# EAGLE board pm3-16 (EAGLE 7.4.0)
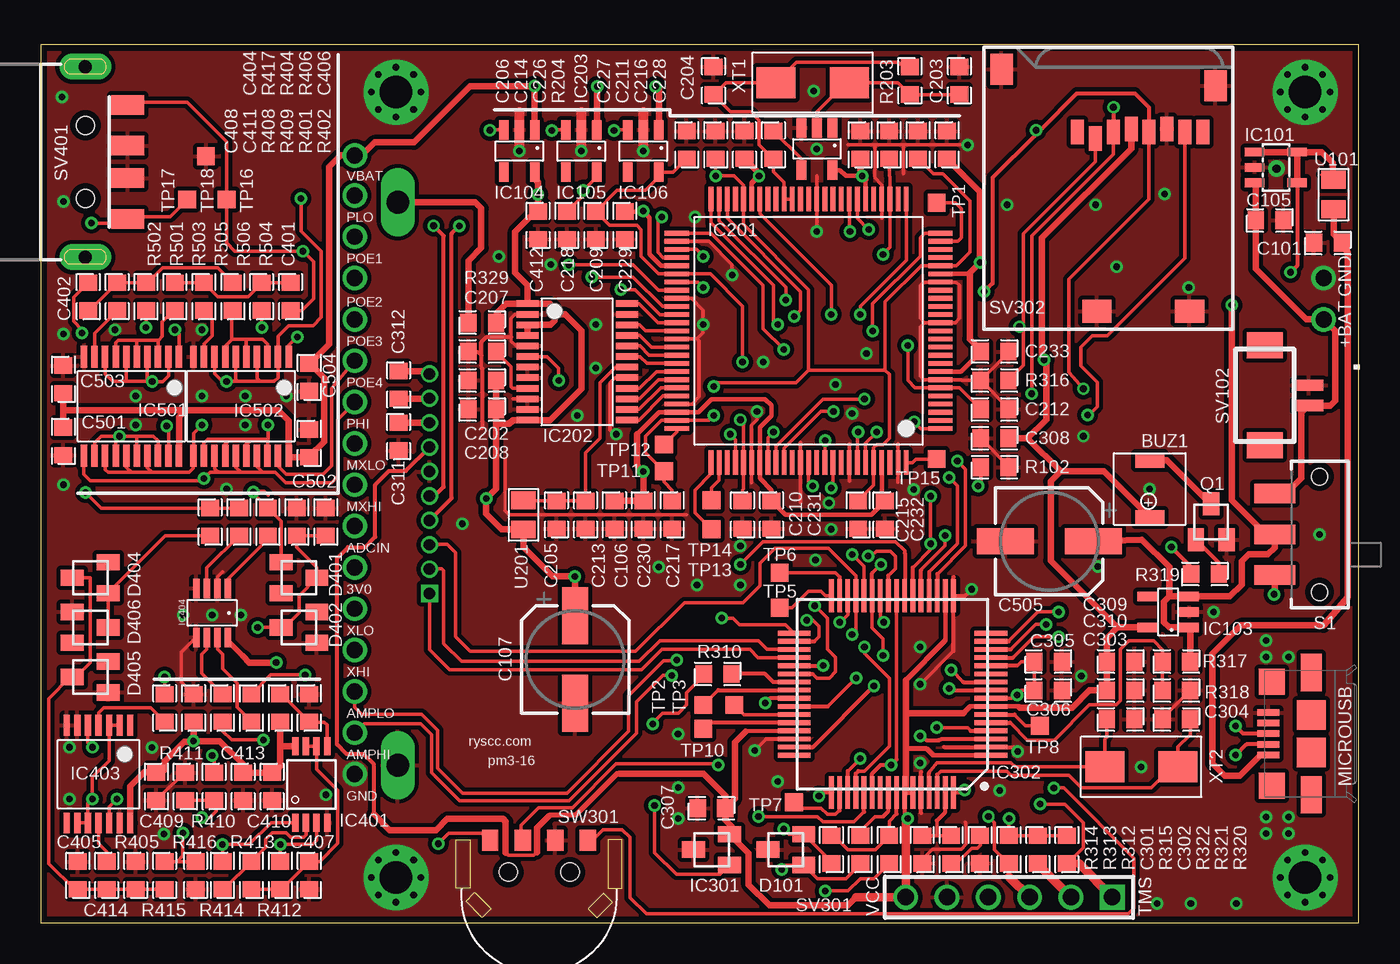
[diagram p5: board, top side]
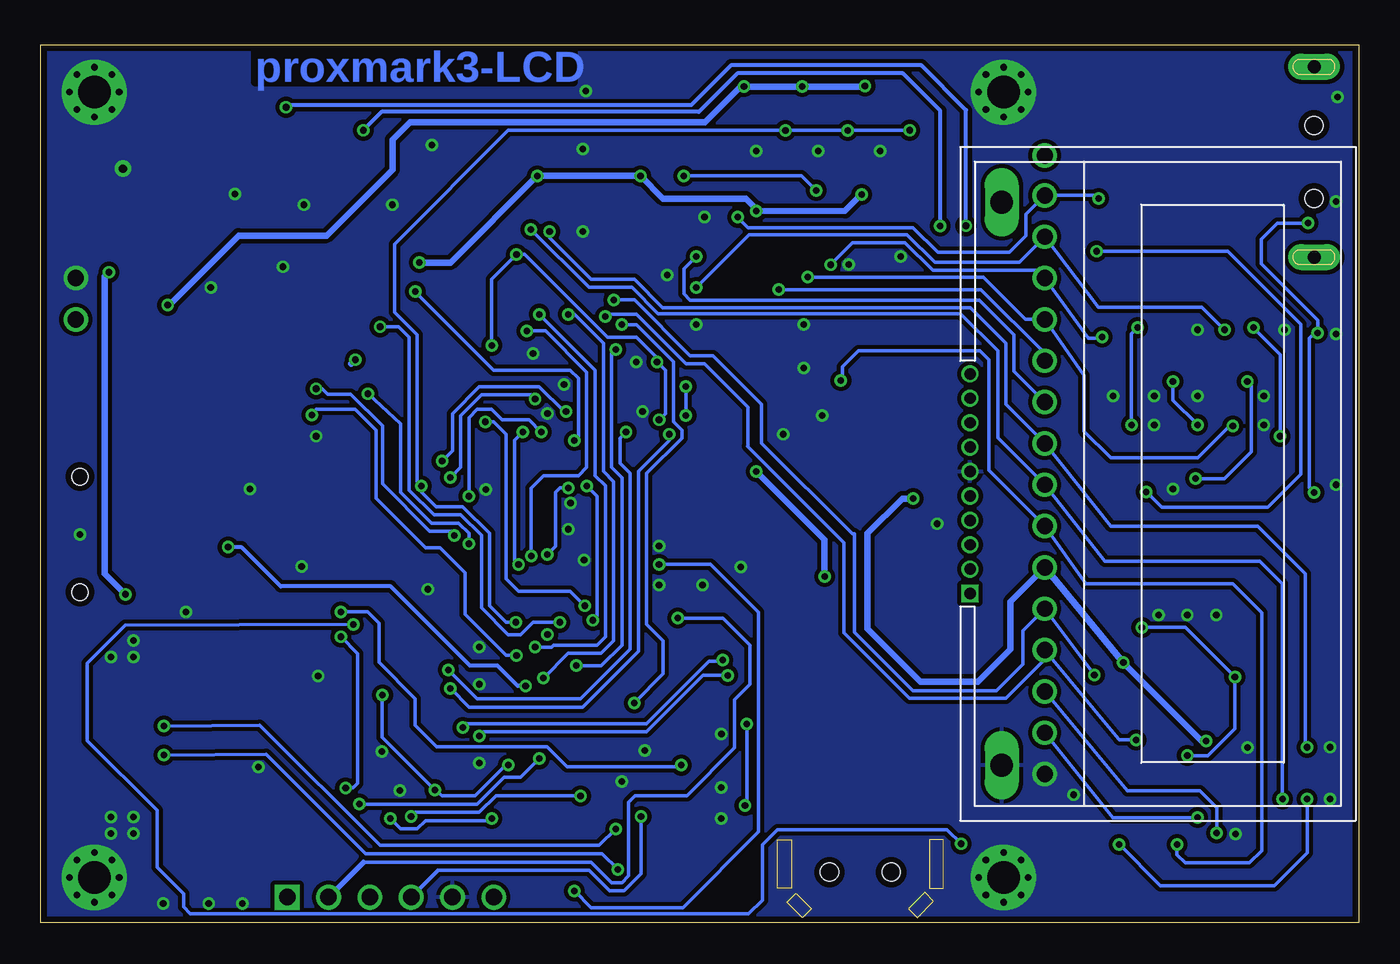
[diagram p6: board, bottom side, seen from below]

Size 81.03 x 53.98 mm. Coordinates in mm from the lower left corner, seen from the top.
Outline: 81.03,0 81.03,53.98 0,53.98 0,0 81.03,0
Copper layers (1*16): Top 0.0356mm / dielectric 1.5011mm / Bottom 0.0356mm
Design rules "LaenPCBOrder": minimum track width 6mil, minimum drill 13mil, track to track 6mil, track to pad 6mil, pad to pad 6mil, via to via 6mil, smd to smd 6mil, copper to edge 15mil, drill to drill 6mil, minimum pad ring 7mil, minimum via ring 7mil, stop-mask expansion 3mil, vias tented up to drill 0mil, thermal gap 10mil

## Footprints (pad centres in the part's own frame; a part is rotated, then mirrored left to right if it is on the bottom)
BUZZER_SMD = smd 0.9 x 1.8: P$1 -1.75,0; P$2 1.75,0
0603 = smd 1 x 1.1: 1 -0.85,0; 2 0.85,0
153CLV-0605 = smd 3.5 x 1.6: + 2.7,0; - -2.7,0
SOT-23-3 = smd 1 x 1.4: 1 -0.95,-1.1; 2 0.95,-1.1; 3 0,1.1
SOT23-5L = smd 0.55 x 1.2: 1 -0.95,-1.3; 2 0,-1.3; 3 0.95,-1.3; 4 0.95,1.3; 5 -0.95,1.3
SOT-23-5 = smd 0.6 x 1.2: 1 -0.95,-1.3; 2 0,-1.3; 3 0.95,-1.3; 4 0.95,1.3; 5 -0.95,1.3
VQ100 = smd 1.5 x 0.29: 1 -8.1,6; 2 -8.1,5.5; 3 -8.1,5; 4 -8.1,4.5; 5 -8.1,4; 6 -8.1,3.5; 7 -8.1,3; 8 -8.1,2.5; 9 -8.1,2; 10 -8.1,1.5; 11 -8.1,1; 12 -8.1,0.5; 13 -8.1,0; 14 -8.1,-0.5; 15 -8.1,-1; 16 -8.1,-1.5; 17 -8.1,-2; 18 -8.1,-2.5; 19 -8.1,-3; 20 -8.1,-3.5; 21 -8.1,-4; 22 -8.1,-4.5; 23 -8.1,-5; 24 -8.1,-5.5; 25 -8.1,-6; 51 8.1,-6; 52 8.1,-5.5; 53 8.1,-5; 54 8.1,-4.5; 55 8.1,-4; 56 8.1,-3.5; 57 8.1,-3; 58 8.1,-2.5; 59 8.1,-2; 60 8.1,-1.5; 61 8.1,-1; 62 8.1,-0.5; 63 8.1,0; 64 8.1,0.5; 65 8.1,1; 66 8.1,1.5; 67 8.1,2; 68 8.1,2.5; 69 8.1,3; 70 8.1,3.5; 71 8.1,4; 72 8.1,4.5; 73 8.1,5; 74 8.1,5.5; 75 8.1,6 | smd 0.29 x 1.5: 26 -6,-8.1; 27 -5.5,-8.1; 28 -5,-8.1; 29 -4.5,-8.1; 30 -4,-8.1; 31 -3.5,-8.1; 32 -3,-8.1; 33 -2.5,-8.1; 34 -2,-8.1; 35 -1.5,-8.1; 36 -1,-8.1; 37 -0.5,-8.1; 38 0,-8.1; 39 0.5,-8.1; 40 1,-8.1; 41 1.5,-8.1; 42 2,-8.1; 43 2.5,-8.1; 44 3,-8.1; 45 3.5,-8.1; 46 4,-8.1; 47 4.5,-8.1; 48 5,-8.1; 49 5.5,-8.1; 50 6,-8.1; 76 6,8.1; 77 5.5,8.1; 78 5,8.1; 79 4.5,8.1; 80 4,8.1; 81 3.5,8.1; 82 3,8.1; 83 2.5,8.1; 84 2,8.1; 85 1.5,8.1; 86 1,8.1; 87 0.5,8.1; 88 0,8.1; 89 -0.5,8.1; 90 -1,8.1; 91 -1.5,8.1; 92 -2,8.1; 93 -2.5,8.1; 94 -3,8.1; 95 -3.5,8.1; 96 -4,8.1; 97 -4.5,8.1; 98 -5,8.1; 99 -5.5,8.1; 100 -6,8.1
TSSOP24 = smd 0.4 x 1.35: 1 -3.575,-3.05; 2 -2.925,-3.05; 3 -2.275,-3.05; 4 -1.625,-3.05; 5 -0.975,-3.05; 6 -0.325,-3.05; 7 0.325,-3.05; 8 0.975,-3.05; 9 1.625,-3.05; 10 2.275,-3.05; 11 2.925,-3.05; 12 3.575,-3.05; 13 3.575,3.05; 14 2.925,3.05; 15 2.275,3.05; 16 1.625,3.05; 17 0.975,3.05; 18 0.325,3.05; 19 -0.325,3.05; 20 -0.975,3.05; 21 -1.625,3.05; 22 -2.275,3.05; 23 -2.925,3.05; 24 -3.575,3.05
LQFP64 = smd 0.29 x 2: 1 -3.75,-6.05; 2 -3.25,-6.05; 3 -2.75,-6.05; 4 -2.25,-6.05; 5 -1.75,-6.05; 6 -1.25,-6.05; 7 -0.75,-6.05; 8 -0.25,-6.05; 9 0.25,-6.05; 10 0.75,-6.05; 11 1.25,-6.05; 12 1.75,-6.05; 13 2.25,-6.05; 14 2.75,-6.05; 15 3.25,-6.05; 16 3.75,-6.05; 33 3.75,6.05; 34 3.25,6.05; 35 2.75,6.05; 36 2.25,6.05; 37 1.75,6.05; 38 1.25,6.05; 39 0.75,6.05; 40 0.25,6.05; 41 -0.25,6.05; 42 -0.75,6.05; 43 -1.25,6.05; 44 -1.75,6.05; 45 -2.25,6.05; 46 -2.75,6.05; 47 -3.25,6.05; 48 -3.75,6.05 | smd 2 x 0.29: 17 6.05,-3.75; 18 6.05,-3.25; 19 6.05,-2.75; 20 6.05,-2.25; 21 6.05,-1.75; 22 6.05,-1.25; 23 6.05,-0.75; 24 6.05,-0.25; 25 6.05,0.25; 26 6.05,0.75; 27 6.05,1.25; 28 6.05,1.75; 29 6.05,2.25; 30 6.05,2.75; 31 6.05,3.25; 32 6.05,3.75; 49 -6.05,3.75; 50 -6.05,3.25; 51 -6.05,2.75; 52 -6.05,2.25; 53 -6.05,1.75; 54 -6.05,1.25; 55 -6.05,0.75; 56 -6.05,0.25; 57 -6.05,-0.25; 58 -6.05,-0.75; 59 -6.05,-1.25; 60 -6.05,-1.75; 61 -6.05,-2.25; 62 -6.05,-2.75; 63 -6.05,-3.25; 64 -6.05,-3.75
MSOP8 = smd 0.4 x 1.1: 1 -0.975,-2.35; 2 -0.325,-2.35; 3 0.325,-2.35; 4 0.975,-2.35; 5 0.975,2.35; 6 0.325,2.35; 7 -0.325,2.35; 8 -0.975,2.35
TSSOP14 = smd 0.381 x 1.27: 1 -1.95,-3; 2 -1.3,-3; 3 -0.65,-3; 4 0,-3; 5 0.65,-3; 6 1.3,-3; 7 1.95,-3; 8 1.95,3; 9 1.3,3; 10 0.65,3; 11 0,3; 12 -0.65,3; 13 -1.3,3; 14 -1.95,3
SOT-23-8 = smd 0.4 x 1.2: 1 -0.975,-1.5; 2 -0.325,-1.5; 3 0.325,-1.5; 4 0.975,-1.5; 5 0.975,1.5; 6 0.325,1.5; 7 -0.325,1.5; 8 -0.975,1.5
TSSOP20 = smd 0.4 x 1.35: 1 -2.925,-3.05; 2 -2.275,-3.05; 3 -1.625,-3.05; 4 -0.975,-3.05; 5 -0.325,-3.05; 6 0.325,-3.05; 7 0.975,-3.05; 8 1.625,-3.05; 9 2.275,-3.05; 10 2.925,-3.05; 11 2.925,3.05; 12 2.275,3.05; 13 1.625,3.05; 14 0.975,3.05; 15 0.325,3.05; 16 -0.325,3.05; 17 -0.975,3.05; 18 -1.625,3.05; 19 -2.275,3.05; 20 -2.925,3.05
NHD-C0216CZ-FSW-FBW-3V3 = drill 0.7 square: 1 27.45,0.6 | drill 0.7: 2 25.95,0.6; 3 24.45,0.6; 4 22.95,0.6; 5 21.45,0.6; 6 19.95,0.6; 7 18.45,0.6; 8 16.95,0.6; 9 15.45,0.6; 10 13.95,0.6 | drill 1.4 long: A 3.4,2.55; K 38,2.55
1981584-1 = smd 0.4 x 1.35: 1 -1.3,4.1; 2 -0.65,4.1; 3 0,4.1; 4 0.65,4.1; 5 1.3,4.1 | smd 1.8 x 1.8: M1 -1.15,1.45; M2 1.15,1.45 | smd 2.3 x 1.3: S1 -3.75,1.45; S2 3.75,1.45 | smd 1.6 x 1.6: S3 -3.2,3.885; S4 3.2,3.885
SWITCH-SPDT-SMD = smd 1.2 x 2.5: 1 -2.5,-2.75; 2 0,-2.75; 3 2.5,-2.75 | hole 1: -3.55,0; 3.55,0
DF13C-2P-1.25V = smd 1.6 x 2.2: M$0 3.075,-1.8; M$1 -3.075,-1.8 | smd 0.7 x 1.8: P$1 -0.625,0.9; P$2 0.625,0.9
HEADER-1X6 = drill 1.016 square: 1 -6.35,0 | drill 1.016: 2 -3.81,0; 3 -1.27,0; 4 1.27,0; 5 3.81,0; 6 6.35,0
3M-MICROSD = smd 0.8 x 1.5: 1 -1.89,3.45; 2 -0.79,3.05; 3 0.31,3.45; 4 1.41,3.65; 5 2.51,3.45; 6 3.61,3.65; 7 4.71,3.45; 8 5.81,3.45 | smd 1.4 x 1.9: 9 6.6,6.3; 10 -6.55,7.3 | smd 1.8 x 1.4: 11 -0.7,-7.55; 12 5,-7.55
USB-A-SMT-MALE = smd 1.2 x 2: D+1 1,-5.35; D-1 -1,-5.35; GND1 3.5,-5.35; VBUS1 -3.5,-5.35 | drill 0.8 pad 1.6 long: P$1 5.85,-2.75; P$3 -5.85,-2.75 | hole 1.1: 2.25,-2.75; -2.25,-2.75
SLLB510100 = smd 1 x 1.3: 1 -2.99,-0.952; 2 3.01,-0.952; C -0.99,-0.952; T 1.01,-0.952 | hole 1.1: -1.9,1; 1.9,1
TP06SQ = smd 1.1 x 1.1: TP 0,0
0805 = smd 1.1 x 1.5: 1 -0.9,0; 2 0.9,0
6035 = smd 2.4 x 1.9: 1 -2.25,0; 2 2.25,0

## Placement (x,y rotation side)
BUZ1  BUZZER_SMD  [BUZZER_SMD]  68.18,26.67 90 top
C101  1u  [0603]  79.12,41.78 180 top
C105  1u  [0603]  75.54,43.17 0 top
C106  4u7  [0603]  35.27,25.08 270 top
C107  100u  [153CLV-0605]  32.85,16.19 90 top
C202  1u  [0603]  27.14,33.33 180 top
C203  22p  [0603]  56.48,51.75 90 top
C204  22p  [0603]  41.36,51.75 90 top
C205  1u  [0603]  31.71,25.08 270 top
C206  4u7  [0603]  39.71,47.81 90 top
C207  100n  [0603]  27.14,35.11 180 top
C208  100n  [0603]  27.14,31.55 180 top
C209  100n  [0603]  34.12,42.86 270 top
C210  100n  [0603]  43.14,25.08 270 top
C211  100n  [0603]  52.16,47.81 90 top
C212  100n  [0603]  58.63,31.55 0 top
C213  100n  [0603]  33.49,25.08 270 top
C214  100n  [0603]  41.49,47.81 90 top
C215  100n  [0603]  50.25,25.08 270 top
C216  100n  [0603]  53.94,47.81 90 top
C217  100n  [0603]  38.82,25.08 270 top
C218  4u7  [0603]  32.35,42.86 270 top
C226  100n  [0603]  43.27,47.81 90 top
C227  100n  [0603]  50.38,47.81 90 top
C228  100n  [0603]  55.71,47.81 90 top
C229  100n  [0603]  35.9,42.86 270 top
C230  100n  [0603]  37.04,25.08 270 top
C231  100n  [0603]  44.92,25.08 270 top
C232  100n  [0603]  51.9,25.08 270 top
C233  100n  [0603]  58.63,35.11 0 top
C301  2n  [0603]  54.19,4.5 90 top
C302  33n  [0603]  57.75,4.5 90 top
C303  22p  [0603]  66.38,12.5 180 top
C304  22p  [0603]  69.81,12.5 0 top
C305  4u7  [0603]  61.94,16.06 0 top
C306  100n  [0603]  61.94,14.28 0 top
C307  100n  [0603]  41.24,7.04 180 top
C308  100n  [0603]  58.63,29.78 180 top
C309  100n  [0603]  66.38,16.06 0 top
C310  4u7  [0603]  66.38,14.28 0 top
C311  1uF  [0603]  22,29.88 270 top
C312  470n  [0603]  22,33.06 270 top
C401  1n  [0603]  15.37,38.48 90 top
C402  47p  [0603]  2.92,38.48 270 top
C404  22p  [0603]  10.41,24.64 270 top
C405  130p  [0603]  2.29,2.92 90 top
C406  1n  [0603]  17.53,24.64 90 top
C407  1u  [0603]  16.51,2.92 270 top
C408  1n  [0603]  7.62,13.21 270 top
C409  100n  [0603]  7.11,8.38 270 top
C410  100n  [0603]  14.22,8.38 270 top
C411  100n  [0603]  9.4,13.21 90 top
C412  4u7  [0603]  30.57,42.86 270 top
C413  4u7  [0603]  12.45,8.38 270 top
C414  1n  [0603]  4.06,2.92 90 top
C501  100n  [0603]  1.4,29.59 270 top
C502  100n  [0603]  16.51,29.46 90 top
C503  4u7  [0603]  1.4,33.4 90 top
C504  4u7  [0603]  16.51,33.53 270 top
C505  100u  [153CLV-0605]  62,23.45 0 top
D101  ESDA6V1L  [SOT-23-3]  45.81,4.5 90 top
D401  BAS21  [SOT-23-3]  15.88,21.21 270 top
D402  BZX84C47  [SOT-23-3]  15.88,18.16 90 top
D404  BAR18  [SOT-23-3]  3.05,21.21 90 top
D405  BZX84C47  [SOT-23-3]  3.05,15.11 90 top
D406  BAR18  [SOT-23-3]  3.05,18.16 270 top
IC101  MCP73811/2  [SOT23-5L]  75.93,46.42 270 top
IC103  MCP1824T-300  [SOT-23-5]  69.3,19.11 90 top
IC104  MCP1824T-300  [SOT-23-5]  29.42,47.43 180 top
IC105  MCP1824T-250  [SOT-23-5]  33.23,47.43 180 top
IC106  MCP1824T-120  [SOT-23-5]  37.04,47.43 180 top
IC201  XC3S250EVQ100  [VQ100]  47.2,36.38 180 top
IC202  ADC08L060  [TSSOP24]  32.98,34.48 270 top
IC203  7404  [SOT-23-5]  47.71,47.56 180 top
IC301  MCP100  [SOT-23-3]  41.24,4.5 90 top
IC302  AT91SAM7S512  [LQFP64]  52.36,14.05 90 top
IC401  AD8052  [MSOP8]  16.64,8.51 0 top
IC403  CD4066  [TSSOP14]  3.56,9.14 180 top
IC404  TLV3502  [SOT-23-8]  10.54,19.05 180 top
IC501  74AC244  [TSSOP20]  5.59,31.75 180 top
IC502  74AC244  [TSSOP20]  12.32,31.75 180 top
LCD1  NHD-C0216CZ-FSW-FBW-3V3  [NHD-C0216CZ-FSW-FBW-3V3]  24.5,47.69 270 bottom
MICROUSB  1981584-1  [1981584-1]  79.56,11.63 90 top
Q1  MMBT2222  [SOT-23-3]  71.95,24.65 0 top
R102  10k  [0603]  58.63,28 0 top
R203  1M  [0603]  53.43,51.75 90 top
R204  100R  [0603]  45.05,47.81 270 top
R310  10k  [0603]  41.62,15.3 0 top
R312  1k5  [0603]  52.16,4.5 90 top
R313  27R  [0603]  50.38,4.5 90 top
R314  27R  [0603]  48.6,4.5 90 top
R315  330  [0603]  55.97,4.5 90 top
R316  510K  [0603]  58.63,33.33 180 top
R317  100K  [0603]  69.81,16.06 0 top
R318  100K  [0603]  69.81,14.28 180 top
R319  100R  [0603]  71.57,21.44 180 top
R320  10k  [0603]  63.08,4.5 90 top
R321  10k  [0603]  61.3,4.5 90 top
R322  10k  [0603]  59.52,4.5 90 top
R329  33R  [0603]  27.14,36.89 0 top
R401  100K  [0603]  14.73,13.21 270 top
R402  100K  [0603]  16.51,13.21 270 top
R404  240K  [0603]  13.97,24.64 270 top
R405  10k  [0603]  5.84,2.92 90 top
R406  510K  [0603]  15.75,24.64 90 top
R408  1K  [0603]  11.18,13.21 90 top
R409  1K  [0603]  12.95,13.21 270 top
R410  10M  [0603]  10.67,8.38 270 top
R411  240K  [0603]  8.89,8.38 270 top
R412  100K  [0603]  14.73,2.92 90 top
R413  10K  [0603]  12.95,2.92 90 top
R414  10K  [0603]  11.18,2.92 90 top
R415  10M  [0603]  7.62,2.92 90 top
R416  1M  [0603]  9.53,2.92 90 top
R417  240K  [0603]  12.19,24.64 270 top
R501  33R  [0603]  6.48,38.48 90 top
R502  10K  [0603]  4.7,38.48 90 top
R503  33R  [0603]  8.26,38.48 90 top
R504  33R  [0603]  13.59,38.48 90 top
R505  10K  [0603]  10.03,38.48 90 top
R506  33R  [0603]  11.81,38.48 90 top
S1  SPDT  [SWITCH-SPDT-SMD]  78.61,23.88 270 top
SV102  DF13-2P-1.25V  [DF13C-2P-1.25V]  77.05,32.42 270 top
SV301  HEADER-1X6  [HEADER-1X6]  59.52,1.58 180 top
SV302  MICROSD  [3M-MICROSD]  65.62,45.14 0 top
SV401  USBA-SMD-MALE  [USB-A-SMT-MALE]  0,46.76 90 top
SW301  SLLB510100  [SLLB510100]  30.64,4.12 180 top
TP1  TPTP06SQ  [TP06SQ]  55.08,44.25 0 top
TP2  TPTP06SQ  [TP06SQ]  40.73,13.39 90 top
TP3  TPTP06SQ  [TP06SQ]  42.63,13.39 0 top
TP5  TPTP06SQ  [TP06SQ]  45.43,19.36 0 top
TP6  TPTP06SQ  [TP06SQ]  45.43,21.52 0 top
TP7  TPTP06SQ  [TP06SQ]  46.32,7.42 0 top
TP8  TPTP06SQ  [TP06SQ]  61.43,12.12 0 top
TP10  TPTP06SQ  [TP06SQ]  40.73,11.93 0 top
TP11  TPTP06SQ  [TP06SQ]  38.31,27.74 0 top
TP12  TPTP06SQ  [TP06SQ]  38.31,29.4 0 top
TP13  TPTP06SQ  [TP06SQ]  41.24,24.19 0 top
TP14  TPTP06SQ  [TP06SQ]  41.24,25.97 0 top
TP15  TPTP06SQ  [TP06SQ]  55.08,28.51 0 top
TP16  TPTP06SQ  [TP06SQ]  11.43,44.45 0 top
TP17  TPTP06SQ  [TP06SQ]  9.02,44.45 0 top
TP18  TPTP06SQ  [TP06SQ]  10.16,47.12 0 top
U101  FB  [0805]  79.47,44.75 90 top
U201  FB  [0805]  29.68,25.08 270 top
XT1  13.56MHz  [6035]  47.46,51.62 180 top
XT2  16MHz  [6035]  67.65,9.58 180 top

## Tracks (layer width: path | path; a pad name or v marks a point on that pad's centre or on a via)
13.56MHZ
  Top 0.203: IC201.40 IC201.41 45.7,45.5 45.05,46.16 R204.2 45.01,46.96 44.16,47.81 44.16,49.34 43.65,49.84 42.42,49.84 C204.1 41.4,50.9 42.12,51.62 XT1.2 46.47,52.88 52.73,52.88 53.02,52.6 R203.2 53.34,52.6
+1V2  (via drill 0.41)
  Top 0.203: IC106.5 38.88,46.13 C206.1 39.75,46.96 | IC106.5 37.97,46.16 | v43.01,30.92 43.2,30.73 IC201.80 43.2,26.67 43.14,26.6 C210.1 | v53.3,35.49 53.3,33.33 53.75,32.88 IC201.6 56.46,32.88 C212.1 | v51.78,41.08 52.2,41.51 IC201.28 52.2,45.86 52.16,45.91 C211.1 | v43.14,34.48 43.14,37.91 41.16,39.88 IC201.56 37.99,39.88 36.92,40.95 36.92,42.6 36.66,42.86 34.97,42.86 C209.1 35.43,45.02 37.17,45.02 37.99,45.84 IC106.5
  Bottom 0.203: v53.3,35.49 53.3,39.56 v51.78,41.08 51.27,41.08 46.19,36 44.41,36 43.14,34.73 v43.14,34.48 42.63,33.97 42.63,31.3 v43.01,30.92
+2V5  (via drill 0.41)
  Top 0.203: C215.1 51.2,26.88 IC201.96 51.2,29.2 51.4,29.4 51.78,29.4 52.16,29.78 52.16,33.71 51.9,33.97 | 54.1,46.96 C216.1 54.86,46.03 55.46,46.03 57.11,44.38 57.11,41.21 56.28,40.38 IC201.21 54.13,40.38 51.9,38.16 51.9,33.97 | v41.36,31.17 41.07,30.88 IC201.74 38.15,30.88 37.17,29.9 37.17,28.89 TP11.TP 38.31,27.11 38.82,26.6 C217.1 | 47.2,33.97 51.9,33.97 | 47.2,33.97 47.2,38.92 43.2,42.92 IC201.46 43.2,45.33 42.63,45.91 v41.49,45.91 C214.1 | C218.1 33.36,44.72 v33.36,45.02 34.19,45.84 IC105.5 | 47.2,33.97 46.44,33.21 41.62,33.21 v41.36,32.95
  Bottom 0.203: v41.36,31.17 v41.36,32.95 | v41.49,45.91 34.25,45.91 v33.36,45.02
+3V0  (via drill 0.41, 1)
  Top 0.203: C232.1 51.7,26.13 | 29.94,36.76 IC202.3 | v37.03,43.74 36.96,43.71 | 11.52,17.31 IC404.8
  Top 0.279: C232.1 51.05,25.08 45.77,25.08 C231.1 44.92,26.6 44.2,27.32 IC201.82 44.2,30.46 44.92,31.17 44.92,31.81 44.54,32.19 41.24,32.19 40.43,31.38 IC201.73 38.01,31.38 36.66,30.03 | 51.7,26.13 IC201.97 | 43.7,45.45 IC201.45 | 50.7,45.71 IC201.31 | IC201.8 56.55,33.88 C233.1 | IC201.55 38.12,40.38 37.43,41.08 37.43,43.34 v37.03,43.74 | IC203.5 49.14,46.26 49.49,45.91 v50.51,45.91 | 36.96,43.71 C229.1 | 57.05,39.88 IC201.20
  Top 0.305: v44.16,45.91 43.7,45.45 | 12.45,16.38 11.52,17.31
  Top 0.406: 30.38,45.84 IC104.5 30.38,45.72 30.57,45.52 v30.57,44.76 C412.1 | IC202.3 IC202.4 | C227.1 50.38,46.03 v50.51,45.91 50.7,45.71 | C107.+ v32.84,21.28 32.83,21.29 31.46,21.29 29.68,23.08 U201.2 | 36.66,30.03 36.66,28.13 v37.05,27.75 C230.1 C106.1 | 29.94,36.76 31.33,36.76 31.58,37.02 31.58,37.4 | 31.58,37.4 31.58,37.78 31.31,38.05 IC202.1 | v57.75,40.57 57.75,44.93 C228.1 | C208.1 27.99,30.67 28.79,30.67 29.02,30.9 IC202.12 31.31,30.9 33.23,32.83 33.23,36.38 32.22,37.4 31.58,37.4 | C208.1 C202.1 | U201.2 29.68,24.32 | v44.16,45.91 44.16,46.07 C226.1 | C233.1 57.75,35.15 57.75,35.24 57.11,35.87 57.11,39.94 v57.75,40.57 | 14.73,10.79 R401.2 | IC401.8 14.8,10.86 14.73,10.79 | v9.4,11.18 11.01,11.18 12.57,9.61 C413.1 C410.1 14.73,9.61 14.73,10.79 | v9.4,11.18 C411.1 | C412.1 30.4,43.71 29.17,42.48 29.17,39.94 29.93,39.17 IC202.1 | v57.75,40.57 57.05,39.88 | v14.48,16 12.83,16 12.45,16.38 | IC403.14 5.51,8.39 6.37,9.25 7.22,9.25 C409.1 7.62,9.4 7.62,9.94 8.82,11.14 9.36,11.14 v9.4,11.18 | 30.46,43.6 C412.1 | C208.1 27.99,26.67 v27.39,26.07 v27.38,26.07 27.38,25.13 28.33,24.18 U201.2 | IC202.1 28.61,38.05 28.05,37.49 28.05,36.95 R329.2 | IC202.1
  Bottom 0.406: v57.75,40.57 55.84,40.57 v50.51,45.91 v44.16,45.91 42.76,44.51 37.68,44.51 37.03,43.86 v37.03,43.74 31.58,43.75 v30.57,44.76 | v37.05,27.75 32.85,23.55 32.85,21.3 v32.84,21.28 | v9.4,11.18 9.65,11.18 v14.48,16 v19.3,21.84 21.41,19.74 21.41,16.83 23.41,14.83 26.95,14.83 30.2,18.08 30.2,23.93 28.06,26.07 v27.39,26.07
+3V0-MAIN  (via drill 0.41)
  Top 0.203: 60.12,13.3 60.16,13.27 | R320.2 R321.2 R322.2 v59.52,6.41 | v53.3,6.41 53.11,6.6 | 30.5,4.34 30.3,4.15 28.74,4.15 28.57,4.32
  Top 0.254: IC302.59 IC302.58 53.11,6.6 | 43.33,11.75 43.39,11.8 IC302.45 | 20.49,6.67 20.49,9.74 19.86,10.37 18.81,10.37 18.21,10.97 18.21,22.41 18.89,23.09 19.93,23.09 20.56,23.72 20.56,26.92 21.41,27.77 22.43,27.77 LCD1.7
  Top 0.279: 54.87,10.3 IC302.1 | 57.15,13.3 IC302.7 60.12,13.3 | 55.61,17.36 IC302.18 | IC302.58 53.17,8.07
  Top 0.305: 56.73,12.89 57.15,13.3 | 54.87,10.3 54.44,10.73 53.17,10.73 | 53.17,14.92 55.61,17.36 | 31.21,6.55 31.3,6.64 32.9,6.64 35.42,9.17 35.57,9.17
  Top 0.406: 60.16,13.27 60.2,13.23 63.42,13.23 64.48,14.28 C310.1 C309.1 65.53,17.5 66.19,18.16 | 67.59,18.16 IC103.5 66.19,18.16 | SV302.4 67.03,47.57 61.56,42.1 61.56,34.73 v61.68,34.6 61.81,34.48 61.81,30.92 60.67,29.78 | IC301.2 42.57,5.45 | IC301.2 43.52,4.27 43.52,2.35 44.79,1.07 49.62,1.07 50.13,1.58 | IC301.2 42.47,5.58 42.47,5.94 42.09,6.32 C307.1 | 53.17,12.89 53.17,10.73 53.17,8.07 | 53.17,12.89 53.17,14.92 | 53.17,12.89 56.73,12.89 | 60.67,29.78 C308.1 | 53.17,6.28 v53.3,6.41 | 62.7,27.75 60.67,29.78 | 43.33,11.75 43.32,11.75 42.68,11.11 42.68,7.63 C307.1 | C307.1 42.09,7.82 40.74,9.17 35.57,9.17 | 20.49,6.67 21.45,5.71 24.31,5.71 24.99,6.39 28.41,6.39 28.58,6.22 28.58,5.75 28.57,5.75 28.57,4.32 | 62.7,27.75 62.09,27.14 62.09,22.26 66.19,18.16 | 31.21,6.55 30.51,5.85 30.51,4.35 30.5,4.34 | BUZ1.P$1 65.36,27.75 62.7,27.75
  Top 0.508: 53.17,6.28 SV301.6 50.13,1.58
  Bottom 0.203: v59.52,6.41 58.89,5.77 57.87,5.77 57.37,6.28 53.43,6.28 v53.3,6.41
  Bottom 0.406: v61.68,34.6 61.94,34.35
+VBAT  (via drill 0.41, 1)
  Top 0.203: 8.64,31.5 8.77,31.36
  Top 0.406: 1.4,31.5 C503.1 | C501.1 1.4,31.5 | 69.36,20.06 IC103.3 73.11,20.06 73.84,20.79 73.84,22.23 74.25,22.64 75.44,22.64 75.86,23.07 S1.2 75.86,23.87 75.32,23.87 73.22,25.96 v73.22,37.96 | 69.36,20.06 69.05,19.74 69.05,18.47 69.36,18.16 IC103.1 70.66,18.16 R317.2 | 1.4,31.5 8.64,31.5 14.61,31.5 15.24,30.86 IC502.20 15.33,28.61 C502.1 16.51,28.67 17.42,29.58 17.42,33.5 16.54,34.38 C504.1 17.02,34.85 17.73,35.56 17.73,46.46 18.45,47.18 19.27,47.18 v19.3,47.15 | 69.36,20.06 69.36,21.88 67.69,23.55 C505.+ | IC104.1 30.36,48.74 v30.36,51.42 26.4,51.42 22.95,47.97 20.52,47.97 19.7,47.15 v19.3,47.15 | IC105.1 34.21,48.73 v34.21,51.4 | IC106.1 37.99,51.4 v37.8,51.4 | IC501.20 8.51,31.11 8.77,31.36 | 19.32,47.13 v19.3,47.15
  Bottom 0.406: v30.36,51.42 30.38,51.4 v34.21,51.4 v37.8,51.4 38.01,51.4 40.2,49.2 58.33,49.2 59.4,48.13 59.4,46.29 63.46,42.23 68.86,42.23 73.13,37.96 v73.22,37.96
+VBIAS
  Top 0.203: R413.1 R412.1 14.81,2.07 C407.1 17.14,3.77 18.26,4.89 18.26,8.16 16.97,9.45 IC401.6 IC401.7
AD6
  Top 0.203: R318.2 R317.1 68.96,16.78 68.41,17.33 66.89,17.33 66.38,16.82 66.38,13.65 66.13,13.39 64.48,13.39 62.32,11.23 60.67,11.23 59.6,12.3
  Top 0.254: IC302.5 59.6,12.3
AD7
  Top 0.203: TP8.TP 60.54,12.12 59.86,12.8
  Top 0.254: IC302.6 59.86,12.8
ADC0
  Top 0.203: IC201.63 37.17,36.38 36.8,36.75 IC202.22
ADC1
  Top 0.203: IC201.65 37.54,35.38 36.82,36.1 IC202.21
ADC2
  Top 0.203: IC201.66 37.4,34.88 36.83,35.45 IC202.20
ADC3
  Top 0.203: IC201.67 37.27,34.38 36.85,34.8 IC202.19
ADC4
  Top 0.203: IC201.68 37.85,33.88 36.82,32.85 IC202.16
ADC5
  Top 0.203: IC201.69 37.98,33.38 36.8,32.2 IC202.15
ADC6
  Top 0.203: IC201.70 38.12,32.88 36.79,31.55 IC202.14
ADC7
  Top 0.203: IC201.71 38.25,32.38 36.77,30.9 IC202.13
ADC_CLK
  Top 0.203: IC201.62 37.94,36.88 36.77,38.05 IC202.24
ADC_IN  (via drill 0.41, 1)
  Top 0.203: IC202.6 31.13,34.8 31.84,34.09 v31.84,33.33 | R414.2 v11.18,4.83 12.83,4.83 14.16,6.16 IC401.1
  Bottom 0.203: v11.18,4.83 11.18,4.19 10.67,3.68 6.73,3.68 5.97,4.45 5.97,19.05 7.75,20.83 16.76,20.83 v19.3,24.38 22.73,27.81 22.73,34.61 23.29,35.17 30.76,35.17 31.75,34.19 31.75,33.42 v31.84,33.33
ADCDR_HI
  Top 0.203: D404.3 3.05,21.21 3.05,16 2.16,15.11 D405.3 | R415.1 R405.1 C414.1 C405.1 2.08,2.07 0.5,3.65 0.5,13.78 1.83,15.11 D405.3 | 1.97,15.09 D405.3
ADCDR_LO  (via drill 0.41)
  Top 0.203: D401.3 15.88,20.11 15.88,19.05 14.99,18.16 D402.3 v13.34,18.16 | C406.1 R406.1 15.75,23.07 16.98,21.85 D401.3 | D401.3 17.02,21.25 16.85,21.25 | v7.62,15.11 C408.1 | v10.54,10.29 10.67,10.16 R410.1
  Bottom 0.203: v13.34,18.16 10.67,18.16 v7.62,15.11 7.62,11.94 9.27,10.29 v10.54,10.29
AMP_HI  (via drill 0.41, 1)
  Top 0.203: 57.18,11.8 56.98,12 v55.08,12 | R416.2 8.38,3.77 | 8.38,3.77 R415.2 | v19.3,14.22 v19.31,14.22 19.31,13.25 19.74,12.82 23.43,12.82 24.41,11.84 24.41,9.49 25.92,7.98 32.35,7.98 36.15,11.78 36.15,13.95 38.3,16.1 39.05,16.1 v39.11,16.16 | v8.74,5.54 8.74,4.13 8.38,3.77
  Top 0.254: 57.18,11.8 IC302.4
  Bottom 0.203: v55.08,12 54.83,12.25 43.78,12.25 39.94,16.09 39.18,16.09 v39.11,16.16 39.12,16.09 | v19.3,14.22 14.22,8.13 9.78,8.13 8.74,7.09 v8.74,5.54
AMP_LO  (via drill 0.41, 1)
  Top 0.203: R411.2 R410.2 10.79,7.52 10.79,6.87 10.39,6.48 v9.91,6.48 | v19.3,11.68 19.87,12.25 23.35,12.25 24.03,11.57 24.03,9.23 25.74,7.52 32.49,7.52 36.62,11.65 36.62,13.59 38.24,15.21 v38.8,15.21 38.81,15.06
  Top 0.254: v54.06,11.49 54.44,11.23 55.21,11.23 55.4,11.3 IC302.3
  Bottom 0.203: v54.06,11.49 53.81,11.74 43.78,11.74 40.3,15.21 v38.8,15.21 | v19.3,11.68 15.11,6.48 v9.91,6.48
ANT_HI_DRV
  Top 0.203: R506.2 10.88,40.26 7.49,40.26 6.57,39.33 R501.2 R502.2 3,37.63 C402.2
ANT_LO_DRV
  Top 0.203: R503.2 R505.2 10.88,38.48 12.74,38.48 R504.2 C401.2
BAT  (via drill 1)
  Top 0.406: S1.1 76.54,26.38 77.5,27.34 77.5,31.35 SV102.P$2 79.26,31.79 79.57,32.1 79.57,36.39 v78.87,37.08 77.8,37.08 74.68,40.2 74.68,43.16 C105.1 74.69,45.41 IC101.3 74.86,45.45
BUTTON_D  (via drill 0.41)
  Top 0.203: v62.57,17.59 61.05,17.59 59.77,16.3 | v62.28,8.29 62.89,8.29 67.2,3.98 67.2,0.89 66.86,0.55 37.23,0.55 36.22,1.56 36.22,5.25 35.75,5.72 34.57,5.72 33.92,5.07 SW301.1
  Top 0.254: IC302.13 59.77,16.3
  Bottom 0.203: v62.57,17.59 61.54,16.55 61.54,8.58 61.83,8.29 v62.28,8.29
BUTTON_S  (via drill 0.41)
  Top 0.203: v62.57,19.11 61.3,19.11 59.5,17.3 | v41.65,9.69 arc90 41.56,9.78 35.38,9.78 32.69,7.09 30.62,7.09 29.53,6 29.53,5.17 SW301.T
  Top 0.254: IC302.15 59.5,17.3
  Bottom 0.203: 62.83,19.11 v62.57,19.11 60.92,19.11 60.23,18.42 60.23,16.01 58.01,13.78 58.01,12.16 56.68,10.83 49.91,10.83 48.67,9.58 41.9,9.58 v41.65,9.69
BUTTON_U  (via drill 0.41)
  Top 0.203: v61.81,18.35 61.17,18.35 59.63,16.8 | v24.44,4.86 25.08,5.5 27.2,5.5 SW301.2
  Top 0.254: IC302.14 59.63,16.8
  Bottom 0.203: v61.81,18.35 75.82,18.29 78.16,15.95 78.16,11.2 73.88,6.91 73.88,3.42 72.25,1.79 72.25,0.98 71.83,0.56 37.51,0.56 36.67,1.4 36.67,4.8 35.74,5.73 25.31,5.73 v24.44,4.86
CROSS_HI  (via drill 0.41, 1)
  Top 0.203: IC201.48 42.2,43.29 46.7,38.79 46.7,37.65 v46.32,37.27 | v13.69,11.24 11.75,11.24 11.17,11.82 R408.1
  Bottom 0.203: v46.32,37.27 46.19,37.4 44.41,37.4 41.36,34.35 40.22,34.35 37.55,31.68 37.55,29.3 37.57,29.28 31.64,23.35 31.64,17.82 27.62,13.8 21.71,13.8 19.3,16.21 v19.3,16.76 14.79,11.3 14.73,11.24 v13.69,11.24
CROSS_LO  (via drill 0.41, 1)
  Top 0.203: IC201.49 41.7,43.15 45.81,39.05 v45.81,38.29 | v16.26,15.24 14.14,15.24 R409.1
  Bottom 0.203: v45.81,38.29 44.54,38.29 41.11,34.86 39.69,34.86 36.71,31.88 36.71,29.48 31.14,23.91 31,23.91 31,17.87 27.41,14.28 22.27,14.28 20.65,15.9 20.65,17.96 v19.3,19.3 v16.26,15.24
DEBUG
  Top 0.203: IC201.24 56.39,41.88 56.6,42.1 56.6,43.87 56.22,44.26 TP1.TP
FPGA_CCLK  (via drill 0.41)
  Top 0.203: IC201.50 41.2,43.02 45.05,39.17 45.05,37.02 v45.3,36.76 | 44.82,13.8 v44.54,13.52
  Top 0.254: IC302.41 44.82,13.8
  Bottom 0.203: v45.3,36.76 44.41,36.76 42.12,34.48 42.12,30.79 41.62,30.29 41.62,29.78 43.78,27.62 43.78,18.35 42.76,17.33 42.76,15.3 v44.54,13.52
FPGA_DIN  (via drill 0.41)
  Top 0.203: v48.6,37.4 48.6,39.17 44.2,43.57 IC201.44 | 48.38,13.3 v50.13,15.04
  Top 0.254: IC302.42 48.38,13.3
  Bottom 0.203: v50.13,15.04 48.6,16.57 46.57,16.57 45.81,17.33 45.81,27.11 46.44,27.75 46.44,35.62 48.22,37.4 v48.6,37.4
FPGA_DONE  (via drill 0.41)
  Top 0.203: v45.68,35.24 44.41,36.51 44.41,39.17 41.2,42.38 IC201.51 | v48.09,15.8 v48.09,15.81
  Top 0.254: IC302.37 v48.09,15.8
  Bottom 0.203: v45.68,35.24 45.94,34.98 45.94,28 45.3,27.36 45.3,17.08 46.57,15.81 v48.09,15.81
FPGA_DOUT  (via drill 0.41)
  Top 0.203: v50.38,37.4 50.38,37.91 53.2,40.73 IC201.26 | 50.25,9.33 50.63,9.33 52.16,10.85 52.16,15.04 50.63,16.57 v50.63,16.95
  Top 0.254: IC302.52 50.11,9.19 50.25,9.33
  Bottom 0.203: v50.38,37.4 46.95,33.97 46.95,27.49 46.32,26.86 46.32,17.59 46.82,17.08 49.49,17.08 49.62,16.95 v50.63,16.95
FPGA_INITB  (via drill 0.41)
  Top 0.203: 52.11,21.35 52.54,21.78 52.54,22.54 52.23,22.85 51.38,22.85 51.08,22.55 v50.87,22.55 | v51.14,36.38 51.14,38.03 54.06,40.95 54.06,42.1 54.35,42.38 IC201.25
  Top 0.254: IC302.25 52.11,21.35
  Bottom 0.203: v51.14,36.38 50,36.38 47.46,33.84 47.46,28 47.97,27.49 50.1,27.49 50.87,26.72 v50.87,22.55
FPGA_PROGB  (via drill 0.41)
  Top 0.203: v47.59,19.49 48.35,18.73 48.35,16.82 48.86,16.32 48.86,15.43 48.48,15.04 47.71,15.04 47.45,15.3 | IC201.1 54.09,30.38 v53.68,30.79
  Top 0.254: IC302.38 47.45,15.3
  Bottom 0.203: v53.68,30.79 53.17,30.79 52.41,30.03 52.41,21.14 51.65,20.38 48.48,20.38 v47.59,19.49
FPGA_TCK
  Top 0.203: IC201.77 41.7,27.2 41.24,26.73 TP14.TP
FPGA_TDI
  Top 0.203: TP15.TP 53.81,28.51 53.58,28.28 IC201.100
FPGA_TDO
  Top 0.203: TP13.TP 40.22,25.2 40.22,26.6 41.2,27.59 IC201.76
FPGA_TMS
  Top 0.203: IC201.75 39.1,30.19 TP12.TP
GND  (via drill 0.41, 0.51 pad 1.02, 1, 2 pad 4)
  Top 0.203: IC201.59 40,38.38 40.73,37.65 v40.73,36.76 40.73,36.25 40.35,35.88 | 40.35,35.88 IC201.64 | IC201.52 41.07,41.88 42.51,40.45 v42.51,39.81 | v44.03,31.43 44.03,30.92 43.7,30.59 IC201.81 43.7,27.05 | IC201.72 40.04,31.88 40.47,32.32 40.47,35.76 40.35,35.88 | 54.33,36.88 54.06,37.14 54.06,39.17 54.27,39.38 55.28,39.38 55.33,39.43 | 54.33,36.88 54.06,36.62 54.06,33.59 54.27,33.38 IC201.7 56.55,33.38 56.6,33.33 R316.2 | 54.33,36.88 IC201.14 56.21,36.88 56.48,37.14 56.48,39.17 56.27,39.38 IC201.19 | 47.7,45.9 IC201.37 v47.7,42.48 v47.71,42.48 | IC202.17 35.31,33.5 35.01,33.21 35.01,30.29 35.27,30.03 v35.39,30.03 | IC202.2 29.18,37.4 28.92,37.14 28.92,36.01 28.92,35.75 29.21,35.45 IC202.5 | 56.84,20.1 v57.24,20.51 | C233.2 59.48,35.03 R316.2 | C212.2 59.48,31.63 R316.2 | C216.2 53.9,48.66 | 53.05,47.81 53.05,46.03 | 53.05,47.81 56.6,47.81 | 51.27,47.81 49.62,47.81 | 51.27,47.81 53.05,47.81 | 51.27,47.81 51.27,45.78 51.7,45.34 IC201.29 51.7,43.29 | 28.54,28.51 28.54,25.33 28.79,25.08 39.71,25.08 | v54.06,14.66 56.11,16.71 | v43.9,10.6 44.61,11.3 | 46.7,29.53 IC201.87 46.7,25.83 | 49.7,27.15 IC201.93 49.7,29.44 | IC404.2 10.87,21.28 11.18,21.59 | R102.2 59.48,28.08 C308.2 | C304.1 68.96,12.58 R318.1 | 52.7,29.43 IC201.99 52.7,27.07 | C411.2 8.64,14.82 8.64,16.62 IC404.5 | C409.2 8.81,9.23 R411.1 | C301.1 54.19,3.92 54.81,4.54 56.6,4.54 56.88,4.82 56.88,6.17 56.85,6.2 | IC202.10 29.03,32.2 | 27.08,34.24 27.08,34.87 26.84,35.11 C207.2
  Top 0.254: 56.11,16.71 IC302.17 | 44.61,11.3 IC302.46 | IC302.17 56.11,21.25 | IC302.17 56.84,20.1 | 54.11,9.28 IC302.60 54.11,6.74 | 59.83,10.8 IC302.2 55.54,10.8 | 27.08,34.87 27.08,35.67 27.42,36.01 28.92,36.01 | 27.16,34.08 27.13,34.08 27.13,30.41
  Top 0.61: 29.43,49.84 IC104.2 v29.43,47.43 | 33.23,49.84 IC105.2 v33.23,47.43 | v37.05,47.43 IC106.2 37.05,49.84
  other vias: 49.87,31.3 48.45,25.8 54.06,9.84 60.06,10.53 37.99,21.87 43.01,23.17 19.3,9.14 47.63,22.3 48.6,24.19 58.95,8.14 76.2,51.05 79.25,51.05 77.72,52.58 77.72,49.53 77.72,51.05 78.8,49.98 78.8,52.13 76.65,52.13 76.65,49.98 20.32,2.79 23.37,2.79 21.84,4.32 21.84,1.27 21.84,2.79 22.92,1.72 22.92,3.87 20.77,3.87 20.77,1.72 67.65,9.58 20.32,51.05 23.37,51.05 21.84,52.58 21.84,49.53 21.84,51.05 22.92,49.98 22.92,52.13 20.77,52.13 20.77,49.98 45.3,8.69 39.2,8.31 76.2,2.79 79.25,2.79 77.72,4.32 77.72,1.27 77.72,2.79 78.8,1.72 78.8,3.87 76.65,3.87 76.65,1.72 64.1,29.9 9.91,32.38 12.57,30.61 10.54,18.92 44.41,34.48 50.76,34.98 40.22,43.37 47.51,51.11 48.86,33.08 56.98,47.81 59.4,44.13 70.57,39.05 69.09,44.79 75.31,16.35 76.71,16.35 75.32,6.5 76.72,6.5 75.32,5.49 76.72,5.49 75.31,17.36 34.12,36.76 34.12,34.09 28.15,40.95 31.35,40.45 43.01,20.76 75.98,46.34 1.4,26.92 1.4,36.2 1.4,44.32 9.91,36.45 4.57,36.45 5.84,32.38 12.57,32.38 5.84,30.61 15.11,32.38 68.64,1.2 70.7,1.2 73.49,1.2 68.16,26.66 66.13,40.32 54.06,16.95 32.98,31.17 53.67,26.64 40.35,20.76 1.78,7.62 1.78,10.79 1.32,50.75 64.86,44.13 39.2,6.41 78.87,39.62 78.61,23.88 72.1,19.11 47.71,47.56 7.57,5.46 6.83,10.77 17.53,7.87 12.32,18.92 8.76,18.92 63.97,15.17 39.18,11.61 64.98,21.9 11.43,26.67 25.92,24.53
  pour Top (isolate 0.254): 0,0 81.03,0 81.03,53.98 0,53.98
  pour Bottom (isolate 0.254): 0,0 81.03,0 81.03,53.98 0,53.98
I2C_DATA
  Top 0.203: IC302.43 43.22,12.8 TP3.TP
JTAG_TCK  (via drill 0.41)
  Top 0.203: 50.61,6.82 50,6.21 48.09,6.21 47.76,6.54 44.28,6.54 44.44,6.55 v44.12,6.55
  Top 0.254: 50.61,6.82 IC302.53
  Bottom 0.203: 56.6,3.23 47.33,3.23 46.06,1.96 45.17,1.96 44.12,3.02 v44.12,6.55
  Bottom 0.254: 56.6,3.23 SV301.4
JTAG_TDI  (via drill 0.41)
  Top 0.203: v41.87,18.73 42.56,18.73 42.97,18.32 45.8,18.32 IC302.33 | 61.3,3.62 R321.1
  Top 0.508: SV301.2 61.3,3.62
  Bottom 0.203: 61.17,3.74 47.2,3.74 45.94,2.47 45.3,2.47 44.88,2.89 44.88,7.42 44.49,7.81 41.31,7.81 38.37,10.76 38.37,13.72 37.43,14.66 37.43,17.08 39.08,18.73 v41.87,18.73
  Bottom 0.305: 61.17,3.74 SV301.2
JTAG_TDO  (via drill 0.41)
  Top 0.203: 59.52,2.85 R322.1 59.36,3.65 59.36,3.78 58.63,4.5 58.63,6.16 v58.25,6.54 | 48.02,8 48.02,7.99 v47.84,7.81
  Top 0.254: IC302.49 48.02,8
  Top 0.508: 59.52,2.85 SV301.3
  Bottom 0.203: v47.84,7.81 53.05,7.81 54.06,6.79 58,6.79 v58.25,6.54
JTAG_TMS  (via drill 0.41)
  Top 0.203: v61.43,7.3 62.95,7.3 64.1,6.16 64.1,4.63 63.12,3.65 R320.1 63.8,3.65 | 49.61,9.32 v50.38,10.09
  Top 0.254: IC302.51 49.61,9.32
  Top 0.508: 63.8,3.65 SV301.1
  Bottom 0.203: v61.43,7.3 54.19,7.3 52.54,8.95 51.52,8.95 v50.38,10.09
LCD_DATA
  Top 0.203: IC302.35 44.65,16.8 44.11,17.34 38.06,17.34 36.79,16.07 25.88,16.07 24.78,17.17 24.78,21.63 24.65,21.76 23.92,21.76 LCD1.2
LCD_RESET
  Top 0.203: LCD1.1 23.9,16.79 25.13,15.56 36.93,15.56 38.18,16.81 43.59,16.81 44.1,16.3 IC302.36
MISO  (via drill 0.41)
  Top 0.203: 51.11,21.49 v51.65,22.03 | IC201.95 50.7,29.47 v51.4,30.16 | SV302.7 70.33,40.84 65.58,36.09 64.65,36.09 63.93,35.37 63.93,34.23 64.95,33.21 64.95,31.71 64.46,31.22 v64.35,31.22 | v51.78,16.44 51.78,17.46 51.11,18.12 IC302.27
  Top 0.254: IC302.27 51.11,21.49
  Bottom 0.203: v51.4,30.16 51.9,29.65 51.9,22.28 v51.65,22.03 | v51.78,16.44 52.41,16.44 54.95,18.98 54.95,21.52 56.48,23.05 57.37,23.05 60.41,26.09 60.41,30.29 61.68,31.55 64.1,31.55 v64.35,31.22
MOSI  (via drill 0.41)
  Top 0.203: 53.61,21.83 54.7,22.92 v54.7,23.3 v54.7,26.22 | IC201.94 50.2,30.11 v50.25,30.16 | SV302.3 65.93,47.23 60.92,42.22 v60.92,32.53 v60.91,32.52
  Top 0.254: IC302.22 53.61,21.83 | LCD1.5 24.22,26.24 24.77,26.79 24.77,42.22 v24.15,42.84 | v65.94,50.12 65.94,48.6 SV302.3
  Bottom 0.203: v54.7,26.22 54.7,31.05 54.19,31.55 53.3,31.55 52.67,30.92 51.02,30.92 v50.25,30.16 | v54.7,23.3 54.7,23.93 55.33,24.57 56.98,24.57 58.89,26.48 58.89,30.67 v60.91,32.52 60.92,32.7
  Bottom 0.254: v24.15,42.84 24.15,49.95 26.89,52.69 38.6,52.69 41.04,50.25 65.81,50.25 v65.94,50.12
MUX_HI  (via drill 0.41, 1)
  Top 0.203: IC201.32 50.2,43.29 v50.89,42.6 | 4.59,7.51 v4.7,7.62 4.21,7.13 IC403.12
  Bottom 0.203: v50.89,42.6 47.33,39.05 44.66,39.05 43.09,37.44 24.49,37.44 22.2,35.15 22.2,29.82 v19.3,26.92 15.62,22.23 6.1,22.23 4.7,20.83 v4.7,7.62
MUX_LO  (via drill 0.41, 1)
  Top 0.203: IC201.33 49.7,42.52 v49.74,42.48 | 3.29,10.91 v3.17,10.79 2.91,11.06 IC403.5
  Bottom 0.203: v49.74,42.48 49.74,42.1 47.2,39.56 44.54,39.56 42.79,37.81 23.88,37.81 21.7,35.63 21.7,31.86 v19.3,29.46 15.24,24.38 6.22,24.38 3.3,21.46 3.3,10.92 v3.17,10.79
N$1
  Top 0.203: IC202.9 29.02,32.85 28.92,32.95 28.92,34.18 C207.1
N$2
  Top 0.203: R315.2 55.08,5.35 | 55.08,5.35 C301.2 | 55.08,5.35 55.08,6.28
  Top 0.254: IC302.63 55.61,6.81 55.08,6.28
N$3
  Top 0.203: IC203.4 46.76,46.94 R204.1
N$4
  Top 0.203: C203.1 R203.1 52.7,51.62 XT1.1 49.49,51.62 47.71,49.84 IC203.2
N$6
  Top 0.203: R315.1 56.28,3.65 57.23,4.6 57.59,4.6 57.75,4.76 C302.2
N$7
  Top 0.203: 54.61,9.24 55.08,9.84 59.65,9.84 59.9,9.59 XT2.2 | XT2.2 | XT2.2 65.41,11.27 65.53,11.4 C303.2
  Top 0.254: IC302.61 54.61,9.24
N$8
  Top 0.203: C304.2 70.66,11.58 69.9,10.82 XT2.1 69.56,9.58 68.29,8.31 63.97,8.31 63.21,9.08 59.65,9.08 59.4,9.33 55.33,9.33 55.11,9.11
  Top 0.254: IC302.62 55.11,9.11
N$9
  Top 0.406: 21.98,44.32 LCD1.A 21.97,44.27 26.71,44.27 27.08,43.9 27.08,41.48 26.29,40.69 R329.1
N$10
  Top 0.203: TP2.TP 41.64,14.3
  Top 0.254: 41.64,14.3 IC302.40
N$11
  Top 0.203: R313.2 50.38,5.65 51.27,6.54 51.78,6.54
  Top 0.254: IC302.56 52.11,6.87 51.78,6.54
N$12
  Top 0.203: 52.61,6.7 52.16,6.24 R312.2 51.31,4.5 49.62,4.5 48.77,5.35 R314.2
  Top 0.254: 52.61,6.7 IC302.57
N$13  (via drill 0.41)
  Top 0.203: R310.1 40.77,15.21 39.71,14.16 39.71,13.39 39.2,12.89 38.22,12.89 37.62,12.28 v37.62,12.22 | IC301.1 41.76,2.98 39.08,2.98 37.73,4.32 v37.73,7.21
  Bottom 0.203: v37.73,7.21 37.62,7.33 v37.62,12.22
N$14
  Top 0.203: R401.1 14.81,14.06 R402.2 16.53,12.34 17.44,12.34 17.61,12.17 IC401.5
N$16
  Top 0.203: C414.2 4.06,4.37 3.56,4.87 IC403.11
N$17  (via drill 0.41)
  Top 0.203: C401.1 16.04,37.63 16.76,38.35 16.76,40.64 v16.13,41.27 11.94,41.27 11.43,41.78 TP16.TP 11.43,48.01 8.99,50.44 5.35,50.44 SV401.GND1 | 13.97,26.29 13.72,26.53 13.11,26.53 | 13.11,26.53 v13.07,26.49 | 13.11,26.53 arc90 v13.07,26.49 | v13.07,26.49 13.07,26.39 R404.1 14.78,24.68 D401.1
  Bottom 0.203: v13.07,26.49 12.1,25.53 5.59,25.53 3.56,27.56 3.56,36.78 8.05,41.27 v16.13,41.27
N$18  (via drill 0.41)
  Top 0.203: U101.2 78.75,45.97
  Top 0.254: IC101.4 77.23,40.38 v76.83,39.98
  Top 0.406: S1.3 75.86,20.24 v75.82,20.19 | U101.2 79.42,45.8 79.42,46.72 78.76,47.37 IC101.5 | IC101.5 IC101.4 | IC101.5 IC101.1
  Bottom 0.406: v75.82,20.19 77.09,21.46 77.09,39.72 v76.83,39.98
N$20
  Top 0.203: D406.3 D404.1 4.13,20.26 7.66,23.79 C404.2
N$21
  Top 0.406: Q1.3 71.89,25.75 69.22,28.42 BUZ1.P$2
N$23
  Top 0.203: IC404.1 11.52,21.15 13.97,23.61 R404.2
N$24
  Top 0.203: IC404.7 10.87,16.82 11.18,16.51 11.18,15.62 12.06,14.73 12.06,13.25 R409.2
N$25  (via drill 0.41)
  Top 0.203: IC403.9 IC403.10 2.91,7.35 v3.17,7.62 | IC403.2 IC403.3 4.2,9.97 3.17,8.95 v3.17,7.62 | R412.2 v14.73,4.83 16.72,4.83 16.97,5.08 16.97,6.15 IC401.3 | v3.17,7.62 3.29,7.51
  Bottom 0.203: v14.73,4.83 12.19,2.29 5.21,2.29 3.17,4.32 v3.17,7.62
N$28
  Top 0.203: IC404.6 10.22,16.82 9.91,16.51 9.91,15.33 R408.2
N$29
  Top 0.203: IC404.3 10.22,21.81 R417.2
N$31
  Top 0.254: R319.1 72.42,22.13 Q1.1
N$32
  Top 0.203: C408.2 6.77,13.21 3.86,13.21 3.57,12.92 3.57,12.16 IC403.4
N$33  (via drill 0.41)
  Top 0.203: v6.48,36.58 R501.1 | v4.83,29.91 4.87,29.8 4.61,29.55 IC501.14 | v4.83,29.91 4.9,29.84 | v4.83,29.91 3.73,29.91 3.32,29.5 3.32,28.71 IC501.12 | IC501.18 7.21,29.61 6.92,29.91 5.98,29.91 | 5.98,29.91 v4.83,29.91 | IC501.16 5.91,29.84 5.98,29.91
  Bottom 0.203: v6.48,36.58 4.83,34.92 v4.83,29.91
N$34  (via drill 0.41)
  Top 0.203: 13.97,29.72 v13.97,30.61 | v13.59,36.58 R504.1 | 12.95,29.72 13.97,29.72 | 11.56,29.72 10.26,29.72 10.03,29.48 10.03,28.72 IC502.12 | 11.56,29.72 12.95,29.72 | 12.95,29.72 12.9,29.66 | 11.6,29.68 11.56,29.72 | IC502.18 13.94,29.69 13.97,29.72
  Top 0.254: IC502.14 11.34,29.42 11.6,29.68 | IC502.16 12.64,29.41 12.9,29.66
  Bottom 0.203: v13.97,30.61 13.97,36.2 v13.59,36.58
N$36  (via drill 0.41)
  Top 0.203: 60.03,15.8 60.29,16.06 C305.1 C306.1 60.3,14.28 v60.01,14 59.82,13.8 IC302.8 | 52.61,10.04 IC302.24 | v56.8,8.18 56.63,8 IC302.64
  Top 0.254: 60.03,15.8 IC302.12 | IC302.54 51.11,9.17 51.65,9.71 v52.28,9.71 52.61,10.04
  Bottom 0.203: v52.28,9.71 52.41,9.71 54.32,7.81 56.35,7.81 v56.8,8.18 60.03,11.41 60.03,13.98 v60.01,14
N$38
  Top 0.203: 49.11,6.92 48.86,6.66 48.35,6.66 47.97,7.04 46.82,7.04 46.44,7.42 TP7.TP
  Top 0.254: 49.11,6.92 IC302.50
N$41
  Top 0.203: R503.1 8.17,37.63 7.46,36.93 7.48,36.91 7.48,36.04 7.25,35.81 | 5.99,35.81 4.76,35.81 4.61,35.66 IC501.7 | 5.99,35.81 7.25,35.81 | IC501.5 5.91,35.73 5.99,35.81 | IC501.3 7.21,35.78 7.25,35.81
N$42
  Top 0.203: IC502.7 11.34,35.45 11.74,35.85 | 11.74,35.85 11.74,37.56 R506.1 | IC502.3 13.94,35.57 13.63,35.88 12.69,35.88 | 12.69,35.88 11.77,35.88 11.74,35.85 | IC502.5 12.64,35.83 12.69,35.88
N$43  (via drill 0.41)
  Top 0.203: 2.88,39.33 C402.1 2.03,38.44 2.03,36.96 2.53,36.45 v2.53,36.25 | v2.76,26.45 3.72,25.49 C404.1 R417.1 10.43,25.48 | v3.13,43 5.48,43 SV401.VBUS1 5.35,43.39 7.96,43.39 TP17.TP
  Bottom 0.203: v2.76,26.45 3.05,26.74 3.05,35.94 2.74,36.25 v2.53,36.25 2.53,37.04 6,40.51 6,42.01 5.01,43 v3.13,43
N$44
  Top 0.203: R502.1 3.31,36.24 IC501.9
N$45
  Top 0.203: R505.1 10.05,37.61 | R505.1 10.04,37.62 | IC502.9 10.04,35.58 10.56,36.09 10.56,37.11 R505.1
N$52
  Top 0.203: R414.1 11.25,2.07 R413.2 13.84,4.66 13.84,5.15 14.24,5.55 15.08,5.55 15.37,5.26 16.15,5.26 16.31,5.42 IC401.2
N$57
  Top 0.406: C311.1 23.89,30.73 LCD1.8
N$58
  Top 0.406: C312.2 23.87,32.21 LCD1.9
N$59
  Top 0.406: C312.1 23.73,33.91 LCD1.10
NCS0  (via drill 0.41)
  Top 0.203: IC201.91 48.7,26.83 v48.6,26.73 | IC302.28 50.61,21.91 v49.89,22.63
  Bottom 0.203: v48.6,26.73 49.11,26.73 49.36,26.48 49.36,23.16 v49.89,22.63
NCS1  (via drill 0.41)
  Top 0.203: SV302.2 64.83,46.77 60.41,42.35 60.41,36.89 v60.16,36.63 60.41,36.38 60.41,34.26 R316.1 | v49.11,18.47 49.13,18.47 49.61,18.95 IC302.30
  Bottom 0.203: v49.11,18.47 50.76,18.47 51.52,17.71 52.28,17.71 53.94,19.36 53.94,23.81 55.21,25.08 56.86,25.08 58.38,26.6 58.38,36 59.02,36.63 v60.16,36.63
NCS2  (via drill 0.41)
  Top 0.203: v49.87,17.71 50.11,17.95 IC302.29 50.11,21.33 48.41,23.03 45.14,23.03 44.2,22.09 44.2,20.71 43.17,19.68 39.57,19.68 36.58,16.69 26.4,16.69 25.49,17.6 25.49,22.76 24.99,23.26 23.92,23.26 LCD1.3
NRST
  Top 0.254: IC302.39 45.03,14.8 44.54,15.3 R310.2
PA1  (via drill 0.41)
  Top 0.254: IC302.47 47.46,10.8 v51.22,14.56 | R319.2 70.72,21.87 v69.5,23.09
  Bottom 0.254: v51.22,14.56 51.71,14.56 52.95,15.81 54.64,15.81 59.5,20.68 66.26,20.68 68.66,23.07 69.5,23.07 v69.5,23.09
PA7
  Top 0.203: TP5.TP 46.19,19.36 47.2,20.38 47.97,20.38 48.24,20.1 IC302.32
PA8
  Top 0.203: TP6.TP 48.86,21.52 49.11,21.27
  Top 0.254: 49.11,21.27 IC302.31
PCK0  (via drill 0.41)
  Top 0.203: v47.08,18.6 47.46,18.6 47.84,18.22 47.84,17.59 47.56,17.3 | IC201.88 47.2,27.11 v47.46,26.86
  Top 0.254: IC302.34 47.56,17.3
  Bottom 0.203: v47.08,18.6 46.82,18.86 46.82,26.22 v47.46,26.86
PWM
  Top 0.254: IC302.44 41.11,12.3 arc90 TP10.TP
PWR_HI  (via drill 0.41, 1)
  Top 0.203: IC201.53 40.3,41.38 v40.73,40.95 | v6.86,33.27 5.33,33.27 | 5.33,33.27 4.43,33.27 3.98,33.72 3.98,34.79 IC501.8 | v6.86,33.27 6.82,33.31 | 10.92,27.69 10.41,27.69 v10.03,27.3 9.91,27.18 3.05,27.18 2.65,27.58 IC501.11 | 10.92,27.69 12.19,27.69 | 12.19,27.69 12.25,27.74 11.99,28 IC502.15 | 10.92,27.69 10.95,27.71 | v19.3,32 18.27,30.91 18.27,27.45 17.87,27.05 15.05,27.05 14.42,27.69 13.46,27.69 | 12.19,27.69 13.46,27.69 | 13.46,27.69 13.55,27.77 13.29,28.03 IC502.17 | IC501.4 6.56,33.27 v6.86,33.27 | IC501.2 7.86,33.62 7.5,33.27 v6.87,33.27 v6.86,33.27 | IC501.6 5.26,33.34 5.33,33.27 | IC502.13 10.69,27.91 10.92,27.69
  Bottom 0.203: v40.73,40.95 41.49,40.19 41.49,38.67 41.1,38.26 23.32,38.26 21.2,36.14 21.2,33.9 v19.3,32 | v10.03,27.3 8.26,27.3 6.6,28.96 6.6,33.02 v6.86,33.27
PWR_LO  (via drill 0.41, 1)
  Top 0.203: 5.59,27.69 4.14,27.69 3.98,27.85 3.98,28.69 IC501.13 | 5.59,27.69 6.86,27.69 | IC201.54 38.26,40.88 37.93,41.21 37.93,43.11 v38.19,43.37 | v9.91,30.61 9.39,30.09 IC502.11 9.38,27.95 9.12,27.69 6.86,27.69 | 12.12,33.27 v11.43,33.27 11.16,33.27 10.7,33.73 10.7,34.79 IC502.8 | 12.12,33.27 13.48,33.27 | 13.48,33.27 14.37,33.27 14.59,33.5 IC502.2 14.59,36.06 15.24,36.7 16.73,36.7 17.24,37.21 17.24,37.94 17.24,37.95 17.24,41.27 16,42.51 v16,44.51 | IC502.6 11.99,33.4 12.12,33.27 | IC502.4 13.29,33.46 13.48,33.27 | 5.59,27.69 5.26,28.01 IC501.15 | 6.86,27.69 6.56,27.98 IC501.17
  Bottom 0.203: v38.19,43.37 37.55,42.73 27.4,42.73 25.88,41.21 21.47,41.21 20.46,42.22 20.46,43.55 v19.3,44.7 16.2,44.7 v16,44.51 | v9.91,30.61 11.43,32.13 v11.43,33.27
PWR_OE1  (via drill 0.41, 1)
  Top 0.203: IC201.57 40.4,39.38 v40.73,39.05 | IC501.1 8.51,36.19 v8.26,36.45
  Bottom 0.203: v8.26,36.45 9.65,37.85 16,37.85 v19.3,42.16 20.88,40.59 26.07,40.59 27.78,42.3 37.48,42.3 v40.73,39.05
PWR_OE2  (via drill 0.41, 1)
  Top 0.203: IC201.58 37.97,38.88 36.41,40.45 v32.47,40.45 | v15.77,36.01 15.24,35.48 IC502.1
  Bottom 0.203: v19.3,39.62 16.64,35.94 15.84,35.94 arc-90 v15.77,36.01 | v32.47,40.45 31.12,41.8 27.89,41.8 26.19,40.1 19.78,40.1 v19.3,39.62 | v19.31,39.62 v19.3,39.62
PWR_OE3  (via drill 0.41, 1)
  Top 0.203: IC201.60 38.21,37.88 36.41,39.68 v33.87,39.68 | IC501.19 7.86,30.53 v7.74,30.53
  Bottom 0.203: v7.74,30.53 7.95,30.53 9.91,28.57 15.24,28.57 16.89,30.23 16.89,33.66 v19.3,37.08 v19.31,37.09 20.49,37.09 23.08,39.68 v33.87,39.68
PWR_OE4  (via drill 0.41, 1)
  Top 0.203: v19.3,34.54 17.89,32.86 17.89,28.08 17.37,27.56 15.09,27.56 14.6,28.05 IC502.19 | IC201.61 38.08,37.38 36.54,38.92 v35.65,38.92
  Bottom 0.203: v35.65,38.92 23.22,38.92 19.3,35 v19.3,34.54
PWR_ON  (via drill 0.41)
  Top 0.203: IC104.3 27.68,48.73 v27.61,48.71 | IC106.3 35.3,48.73 v35.24,48.7 | IC105.3 31.49,48.73 v31.42,48.7 | 57.78,28.34 R102.1 57.78,27.02 v57.62,26.86 | IC302.26 51.61,18.69 v51.83,18.47
  Bottom 0.203: v27.61,48.71 v31.42,48.7 v35.24,48.7 52.28,48.7 59.27,41.72 59.27,37.52 57.87,36.13 57.87,27.11 v57.62,26.86 57.62,26.48 56.73,25.59 55.08,25.59 53.43,23.93 53.43,19.49 52.41,18.47 v51.83,18.47
SPCK  (via drill 0.41)
  Top 0.203: v55.59,23.81 55.59,23.17 54.11,21.7 | v64.1,32.83 63.21,33.84 63.21,39.56 68.13,44.48 SV302.5 | IC201.90 48.2,29.63 v48.22,29.65
  Top 0.254: IC302.21 54.11,21.7 | v58,38.79 58.51,39.3 58.51,45.78 61.2,48.47 v61.2,48.71 61.44,48.71 63.71,50.98 67.26,50.98 68.13,50.11 SV302.5 | LCD1.4 25.27,26.11 25.27,42.37 v25.73,42.83
  Bottom 0.203: v55.59,23.81 55.84,24.06 57.11,24.06 60.02,26.97 60.02,30.54 61.98,32.5 63.37,32.5 63.39,32.48 63.73,32.83 v64.1,32.83 | v48.22,29.65 47.97,29.9 47.97,33.46 48.48,33.97 53.17,33.97 v58,38.79
  Bottom 0.254: v25.73,42.83 25.73,49.9 28.03,52.2 38.2,52.2 40.57,49.83 60.08,49.83 v61.2,48.71
SSP_CLK  (via drill 0.41)
  Top 0.203: v56.35,28.38 56.86,27.87 56.86,23.17 55.11,21.43 | IC201.85 45.7,29.17 47.97,31.43 v48.73,31.43
  Top 0.254: 55.11,21.43 IC302.19
  Bottom 0.203: v48.73,31.43 48.86,31.43 50.38,32.95 54.06,32.95 55.71,31.3 55.71,29.02 v56.35,28.38
SSP_DIN  (via drill 0.41)
  Top 0.203: v55.97,15.55 56.72,14.8 | IC201.83 44.7,29.82 v45.05,30.16
  Top 0.254: 56.72,14.8 IC302.10
  Bottom 0.203: v55.97,15.55 54.19,13.78 47.84,13.78 44.79,16.82 44.79,27.62 45.43,28.25 45.43,29.78 v45.05,30.16
SSP_DOUT  (via drill 0.41)
  Top 0.203: IC201.79 42.7,29.7 v42.38,30.03 | v55.84,14.41 55.95,14.3
  Top 0.254: 55.95,14.3 IC302.9
  Bottom 0.203: v55.84,14.41 54.7,13.27 47.71,13.27 44.28,16.7 44.28,27.75 42.38,29.65 v42.38,30.03
SSP_FRAME  (via drill 0.41)
  Top 0.203: v50.63,32.19 48.09,32.19 45.2,29.3 IC201.84 | 54.61,21.56 56.35,23.3 56.35,26.86 v55.84,27.36
  Top 0.254: 54.61,21.56 IC302.20
  Bottom 0.203: v55.84,27.36 55.21,28 55.21,31.17 53.94,32.44 50.89,32.44 v50.63,32.19
USB_D+  (via drill 0.41)
  Top 0.203: v45.67,5.77 46,5.45 D101.2 48.71,3.65 R314.1
  Top 0.254: MICROUSB.3 73.92,11.63 v73.45,12.09
  Bottom 0.203: v45.67,5.77 46.7,4.76 60.16,4.76 67.55,12.15 v73.45,12.09
USB_D-  (via drill 0.41)
  Top 0.203: R313.1 50.38,3.62 49.49,2.73 47.74,2.73 D101.1 45.81,3.55 v45.55,3.29
  Top 0.254: v73.45,10.31 74.11,10.98 MICROUSB.2
  Bottom 0.203: v73.45,10.31 67.17,10.37 61.05,4.25 46.51,4.25 v45.55,3.29
USB_PU  (via drill 0.41)
  Top 0.203: v48.22,1.96 49.62,1.96 50.38,2.73 51.23,2.73 R312.1 52.28,3.78 | 53.11,22.73 53.11,22.86 52.54,23.43 44.41,23.43 v43.01,22.03
  Top 0.254: 53.11,22.73 IC302.23
  Bottom 0.203: v48.22,1.96 47.2,0.95 41.56,0.95 36.9,5.61 36.9,19.09 39.84,22.03 v43.01,22.03
VDD
  Top 0.203: IC202.18 35.32,34.15 34.38,33.21 34.38,29.78 33.5,28.9 C213.1 C205.1 29.73,25.93 U201.1
VUSB
  Top 0.406: MICROUSB.1 75.01,10.33 73.72,9.04 72.79,9.04 72.03,9.8 72.03,16.55 73.77,18.29 78.87,18.29 80.35,20 80.35,41.21 79.97,41.7 C101.1 79.97,41.82 79.47,42.32 U101.1

## Text on the board
Bottom: proxmark3-LCD
tPlace: VBAT | PLO | POE1 | GND | POE2 | +BAT | POE3 | POE4 | PHI | MXLO | MXHI | ADCIN | 3V0 | XLO | XHI | AMPLO | AMPHI | GND
tNames: SV102 | ryscc.com | pm3-16 | SW301
tValues: http://032.la